# EAGLE design Girraffe V3.6 (EAGLE 7.7.0)
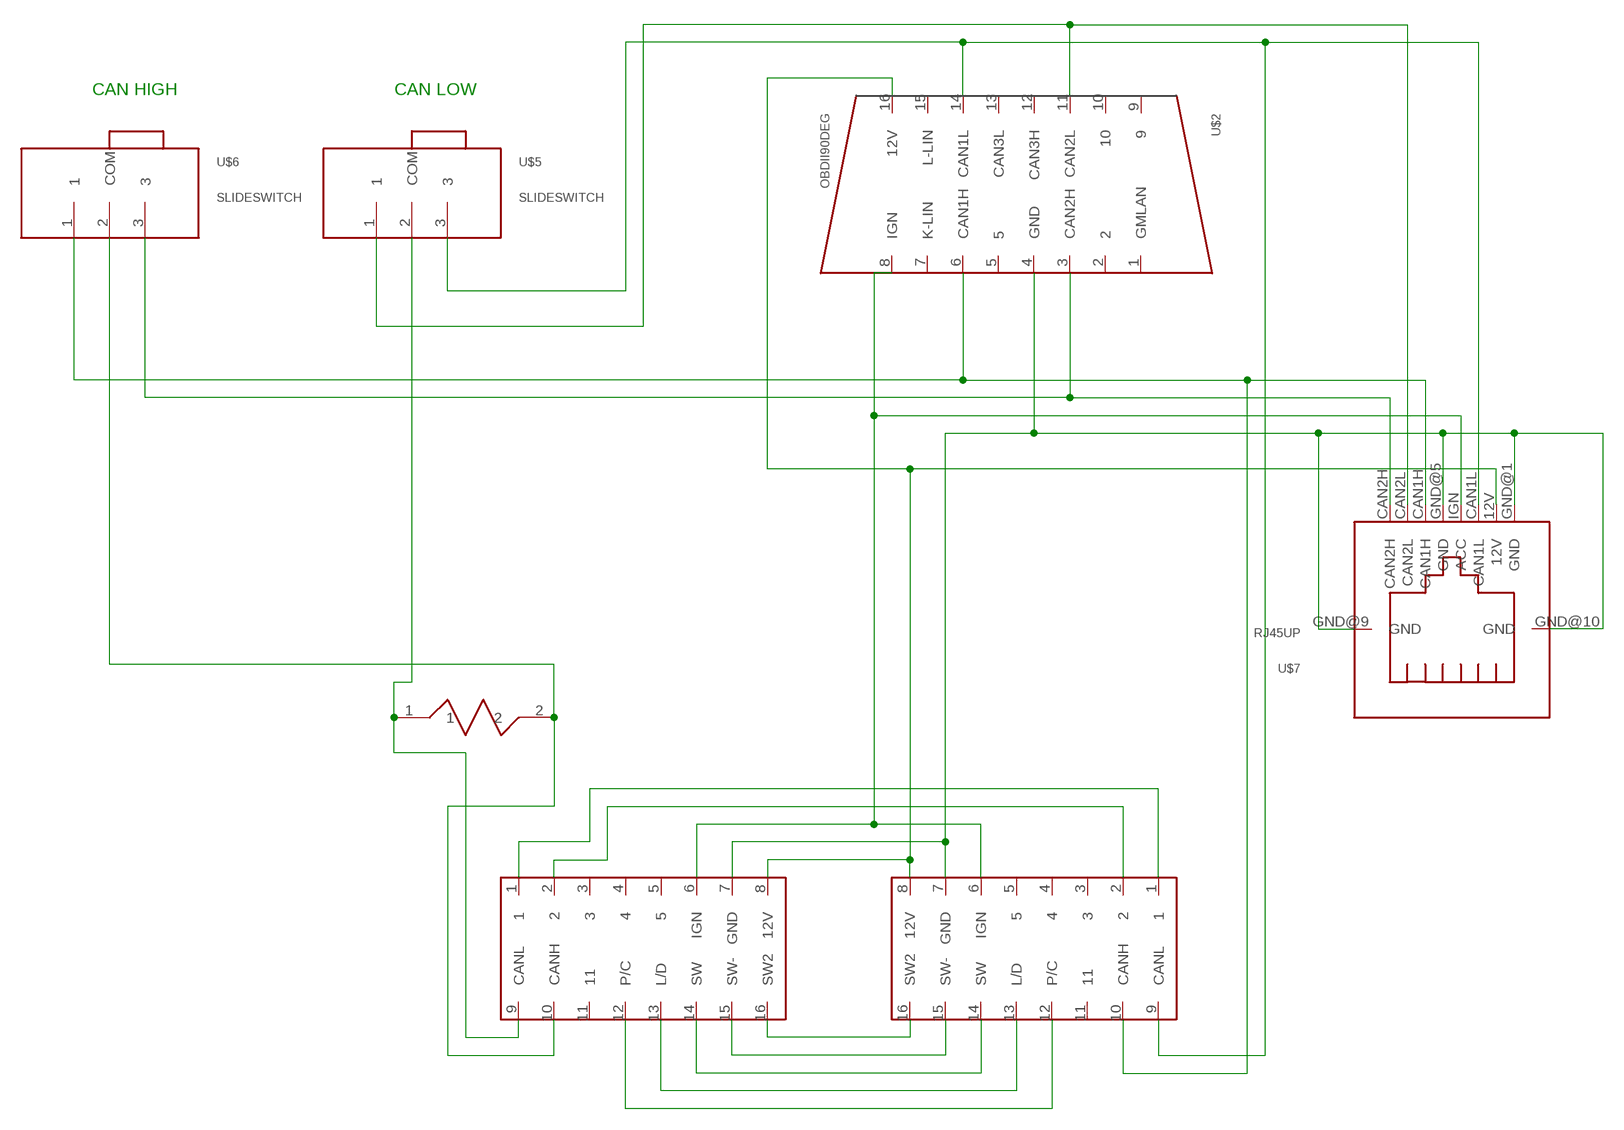
[diagram p0: schematic, sheet 1]

## Parts
U$1  120OHM  [120OHM]
U$2  OBDII90DEG  [OBDII]
U$3  R137IN  [R137]
U$4  R137OUT  [R137OUT]
U$5  SLIDESWITCH  [SLIDESWITCH]
U$6  SLIDESWITCH  [SLIDESWITCH]
U$7  RJ45UP  [VERRJ45]

## Nets
12V: U$2.16(12V) U$3.8(12V) U$4.8(12V) U$7.12V
ACC: U$2.8(IGN) U$3.6(IGN) U$4.6(IGN) U$7.IGN(ACC)
GND: U$2.4(GND) U$3.7(GND) U$4.7(GND) U$7.GND@1(GND) U$7.GND@5(GND) U$7.GND@9(GND) U$7.GND@10(GND)
N$1: U$1.1 U$4.9(CANL) U$5.2(COM)
N$2: U$1.2 U$4.10(CANH) U$6.2(COM)
N$3: U$2.14(CAN1L) U$3.9(CANL) U$5.3 U$7.CAN1L
N$4: U$2.11(CAN2L) U$5.1 U$7.CAN2L
N$5: U$2.6(CAN1H) U$3.10(CANH) U$6.1 U$7.CAN1H
N$6: U$2.3(CAN2H) U$6.3 U$7.CAN2H
N$7: U$3.16(SW2) U$4.16(SW2)
N$8: U$3.15(SW-) U$4.15(SW-)
N$9: U$3.14(SW) U$4.14(SW)
N$10: U$3.13(L/D) U$4.13(L/D)
N$11: U$3.12(P/C) U$4.12(P/C)
N$12: U$3.2 U$4.2
N$13: U$3.1 U$4.1
Unconnected: U$2.1(GMLAN) U$2.2 U$2.5 U$2.7(K-LIN) U$2.9 U$2.10 U$2.12(CAN3H) U$2.13(CAN3L) U$2.15(L-LIN) U$3.3 U$3.4 U$3.5 U$3.11 U$4.3 U$4.4 U$4.5 U$4.11

## Notes on the sheet
- CAN HIGH | CAN LOW

## Library data of the parts
U$1 = Giraffe:120OHM
U$2 = Giraffe:OBDII90DEG
U$3 = Giraffe:R137IN
U$4 = Giraffe:R137OUT
U$5 U$6 = Giraffe:SLIDESWITCH
U$7 = Giraffe:RJ45

## Board
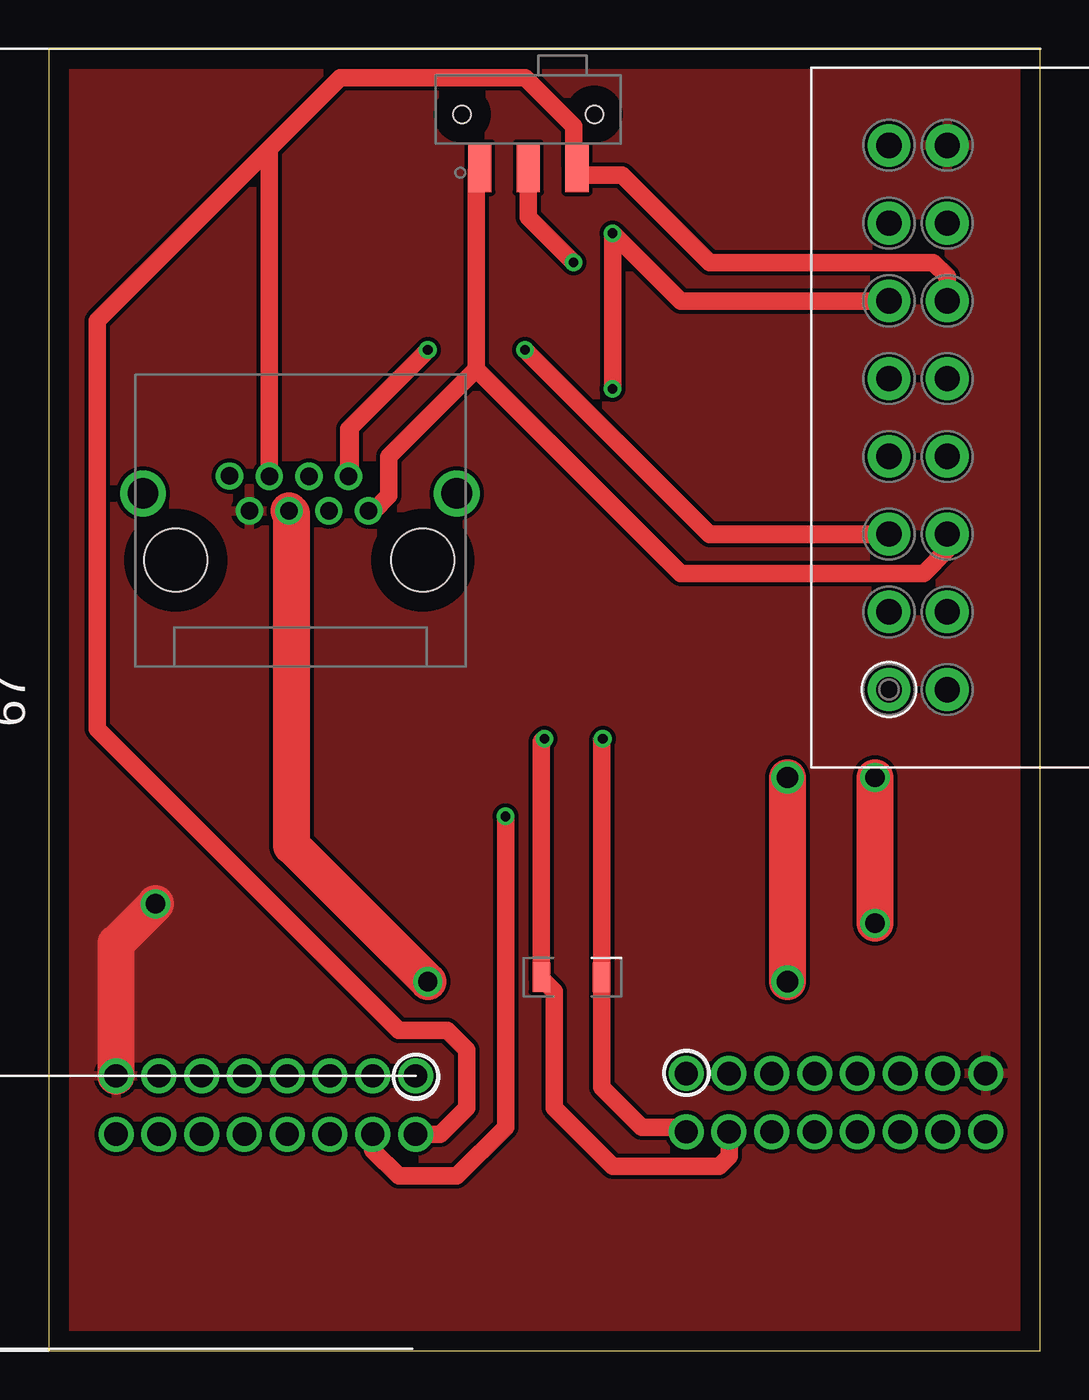
[diagram p1: board, top side]
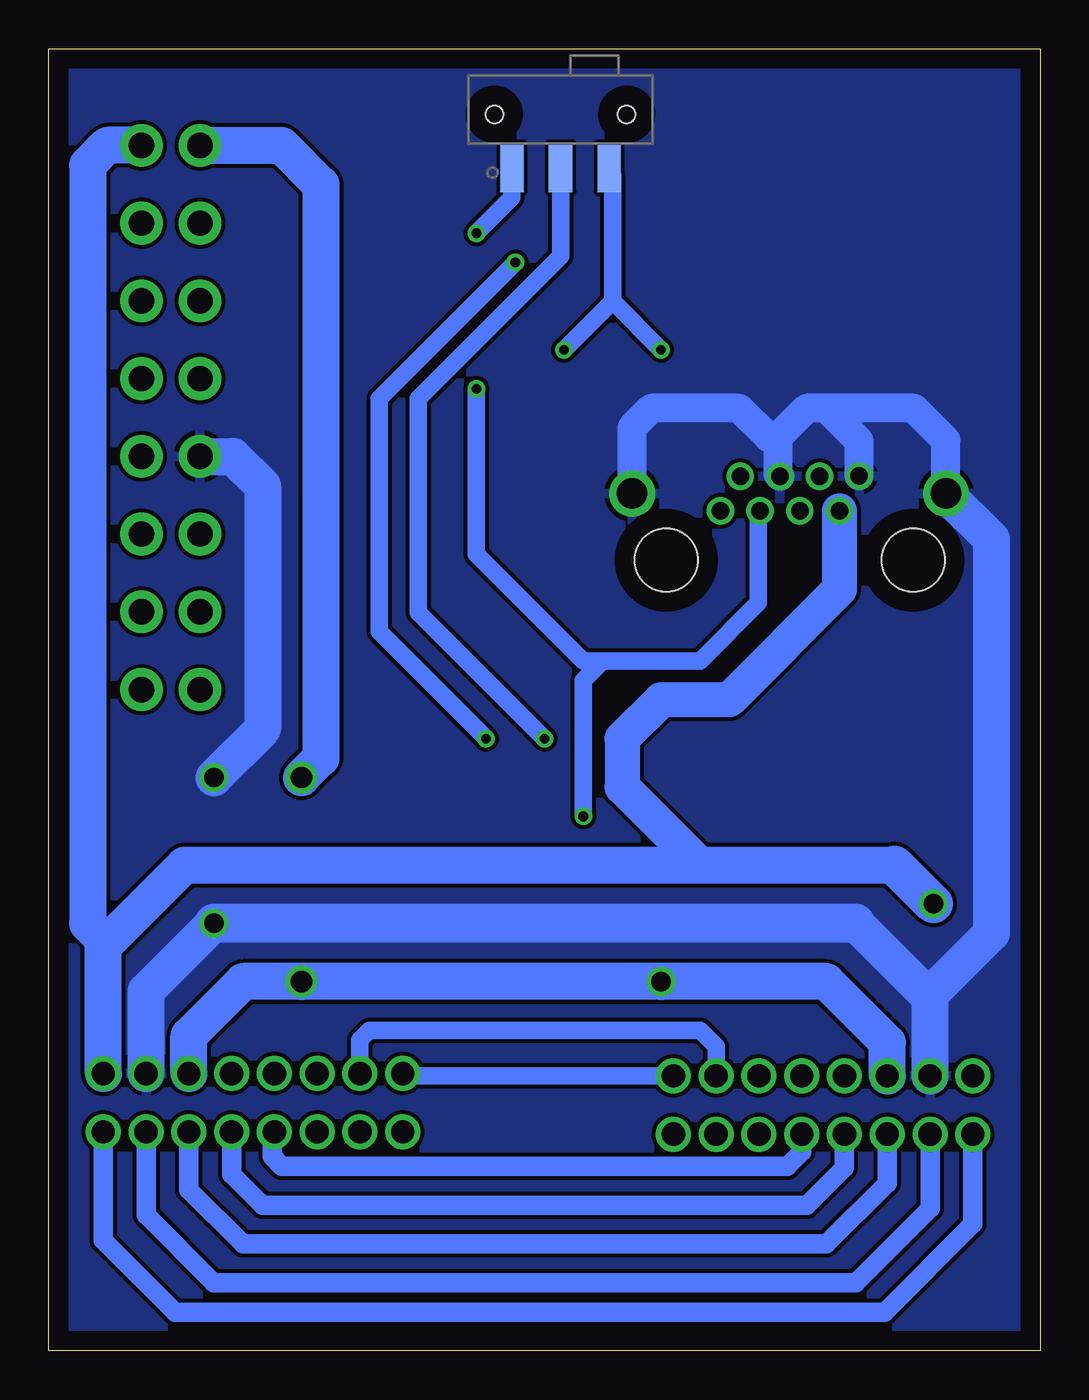
[diagram p2: board, bottom side, seen from below]

Size 51 x 67 mm. Coordinates in mm from the lower left corner, seen from the top.
Outline: 0,0 51,0 51,67 0,67 0,0
Copper layers (1*16): Top 0.035mm / dielectric 1.5mm / Bottom 0.035mm
Design rules "default": minimum track width 10mil, minimum drill 24mil, track to track 8mil, track to pad 8mil, pad to pad 8mil, via to via 8mil, smd to smd 8mil, copper to edge 40mil, drill to drill 8mil, minimum pad ring 10mil, minimum via ring 8mil, stop-mask expansion 4mil, vias tented up to drill 0mil, thermal gap 10mil

### Footprints (pad centres in the part's own frame; a part is rotated, then mirrored left to right if it is on the bottom)
120OHM = smd 0.9 x 1.5: 1 0,0; 2 3.1,0
OBDII = drill 1.3 pad 2.2: 1 0,0; 2 0,-4; 3 0,-8; 4 0,-12; 5 0,-16; 6 0,-20; 7 0,-24; 8 0,-28; 9 -3,0; 10 -3,-4; 11 -3,-8; 12 -3,-12; 13 -3,-16; 14 -3,-20; 15 -3,-24; 16 -3,-28
R137 = drill 1.2: 1 0,0; 2 -2.2,0; 3 -4.4,0; 4 -6.6,0; 5 -8.8,0; 6 -11,0; 7 -13.2,0; 8 -15.4,0; 9 0,-3; 10 -2.2,-3; 11 -4.4,-3; 12 -6.6,-3; 13 -8.8,-3; 14 -11,-3; 15 -13.2,-3; 16 -15.4,-3
R137OUT = drill 1.2: 1 0,0; 2 2.2,0; 3 4.4,0; 4 6.6,0; 5 8.8,0; 6 11,0; 7 13.2,0; 8 15.4,0; 9 0,-3; 10 2.2,-3; 11 4.4,-3; 12 6.6,-3; 13 8.8,-3; 14 11,-3; 15 13.2,-3; 16 15.4,-3
SLIDESWITCH = smd 1.2 x 2.5: 1 -2.5,0; 2 0,0; 3 2.5,0 | hole 0.9: 3.4,2.75; -3.4,2.75
VERRJ45 = drill 0.9: 12V -6.12,0; CAN1H -2.04,0; CAN1L -5.1,1.78; CAN2H -1.02,1.78; CAN2L 0,0; GND@1 -7.14,1.79; GND@5 -3.06,1.78; IGN -4.08,0 | drill 1.57: GND@9 -11.6,0.89; GND@10 4.54,0.89 | hole 3.25: 2.79,-2.54; -9.91,-2.54

### Placement (x,y rotation side)
U$1  28.44,19.23 180 top
U$2  43.22,34.02 180 top
U$3  18.87,14.15 0 top
U$4  32.79,14.27 0 top
U$5  24.67,60.87 0 top
U$6  24.67,60.87 0 bottom
U$7  16.45,43.22 0 top

### Tracks (layer width: path | path; a pad name or v marks a point on that pad's centre or on a via)
12V  (via drill 1)
  Top 1.9: U$3.8 3.47,20.97 v5.5,23
  Bottom 1.8: U$7.12V 10.33,39.17 16,33.5 19.5,33.5 21.5,31.5 21.5,29 17.5,25
  Bottom 1.9: U$4.8 48.19,20.81 48,21 | 48,21 44,25 17.5,25 7.5,25 | U$2.16 47.98,62.02 49,61 49,22 48,21
  Bottom 2: 7.5,25 v5.5,23
  pour Top: 1,66 50,66 50,1 1,1
ACC  (via drill 1, 1.1)
  Top 1.9: v19.5,19 12.5,26 12.5,43.09 U$7.IGN | v38,29.5 v38,19
  Bottom 1.9: U$3.6 7.87,15.87 11,19 v19.5,19 v38,19 41,19 43.79,16.21 U$4.6 | U$2.8 39.02,62.02 37,60 37,30.5 v38,29.5
GND  (via drill 1)
  Top 1.9: v42.5,29.5 v42.5,22
  Bottom 1.5: U$7.GND@9 4.85,46.85 6.5,48.5 11,48.5 | 11,48.5 12,48.5 13.5,47 | 13.5,47 13.5,45.11 U$7.GND@5 | 13.5,47 14,47 15.5,48.5 20,48.5 21,47.5 U$7.GND@10 | U$7.GND@1 9.31,46.81 11,48.5
  Bottom 1.9: U$3.7 5.67,18.17 | 5.67,18.17 9.5,22 | U$4.7 45.99,18.51 v42.5,22 | 5.67,18.17 5.67,18.33 2.5,21.5 2.5,41.76 U$7.GND@9 | U$2.4 41.52,46.02 40,44.5 40,32 v42.5,29.5
  Bottom 2: 9.5,22 v42.5,22
  pour Bottom: 0.5,0.5 50.5,0.5 50.5,66.5 0.5,66.5
N$1  (via drill 0.5)
  Top 0.9: U$5.2 24.67,58.33 v27,56 | v28.5,31.5 28.44,31.44 U$1.1 28.44,13.56 30.5,11.5 32.56,11.5 U$4.9
  Bottom 0.9: v27,56 34,49 34,37 v28.5,31.5
N$2  (via drill 0.5)
  Top 0.9: v25.5,31.5 25.34,31.34 U$1.2 25.34,19.16 26,18.5 26,12.5 29,9.5 34.5,9.5 35,10 U$4.10
  Bottom 0.9: U$6.2 24.67,56.33 32,49 32,38 v25.5,31.5
N$3
  Top 0.9: U$7.CAN1L 11.35,61.85 | 11.35,61.85 15,65.5 24.5,65.5 27,63 27,61.04 U$5.3 27.54,60.5 29.5,60.5 34,56 45.5,56 46.22,55.28 U$2.14 | U$3.9 20.15,11.15 21.5,12.5 21.5,15.5 20.5,16.5 18,16.5 2.5,32 2.5,53 11.35,61.85
N$4
  Top 0.9: U$7.CAN2L 16.72,43.22 17.5,44 17.5,46 22,50.5 | 22,50.5 22,60.7 U$5.1 | U$2.11 46.22,41.22 45,40 32.5,40 22,50.5
N$5  (via drill 0.5)
  Top 0.9: U$3.10 16.67,10.33 18,9 21,9 23.5,11.5 v23.5,27.5 | U$2.6 43.2,54 32.5,54 v29,57.5 v29,49.5
  Bottom 0.9: U$6.1 27.17,59.33 v29,57.5 | 22.5,35.5 23.5,35.5 29,41 v29,49.5 | 22.5,35.5 17.5,35.5 14.5,38.5 14.5,43.13 U$7.CAN1H | v23.5,27.5 23.5,34.5 22.5,35.5
N$6  (via drill 0.5)
  Top 0.9: U$7.CAN2H 15.43,47.43 v19.5,51.5 15.5,47.5 15.5,45 | v24.5,51.5 34,42 43.2,42 U$2.3 33.98,42.02 v24.5,51.5
  Bottom 0.9: U$6.3 22.17,60.67 22,60.5 22,54 | v24.5,51.5 22,54 | 22,54 v19.5,51.5
N$7
  Bottom 1: U$3.16 3.47,6.53 8,2 44.5,2 48.19,5.69 U$4.16
N$8
  Bottom 1: U$3.15 5.67,7.33 9.5,3.5 42.5,3.5 45.99,6.99 U$4.15
N$9
  Bottom 1: U$3.14 7.87,8.63 11,5.5 41,5.5 43.79,8.29 U$4.14
N$10
  Bottom 1: U$3.13 10.07,9.43 12,7.5 40,7.5 41.59,9.09 U$4.13
N$11
  Bottom 1: U$3.12 12.27,10.23 13,9.5 39,9.5 39.5,10 39.5,11.16 U$4.12
N$12
  Bottom 0.9: U$3.2 16.67,15.67 17.5,16.5 34.5,16.5 35,16 U$4.2
N$13
  Bottom 0.9: U$3.1 32.67,14.15 U$4.1
N$14
  pour Bottom: 3.5,10 48,10 48,5.5 44.5,2 8.5,2 3.5,7
N$15
  pour Top: 11.5,46 11.5,65 42,65 42,38.5 29,38.5 21.5,46
N$16
  pour Bottom: 8.5,15 8.5,18 43,18 43,15.5 43,15